# EAGLE design JetBot_Verteiler (EAGLE 9.3.0)
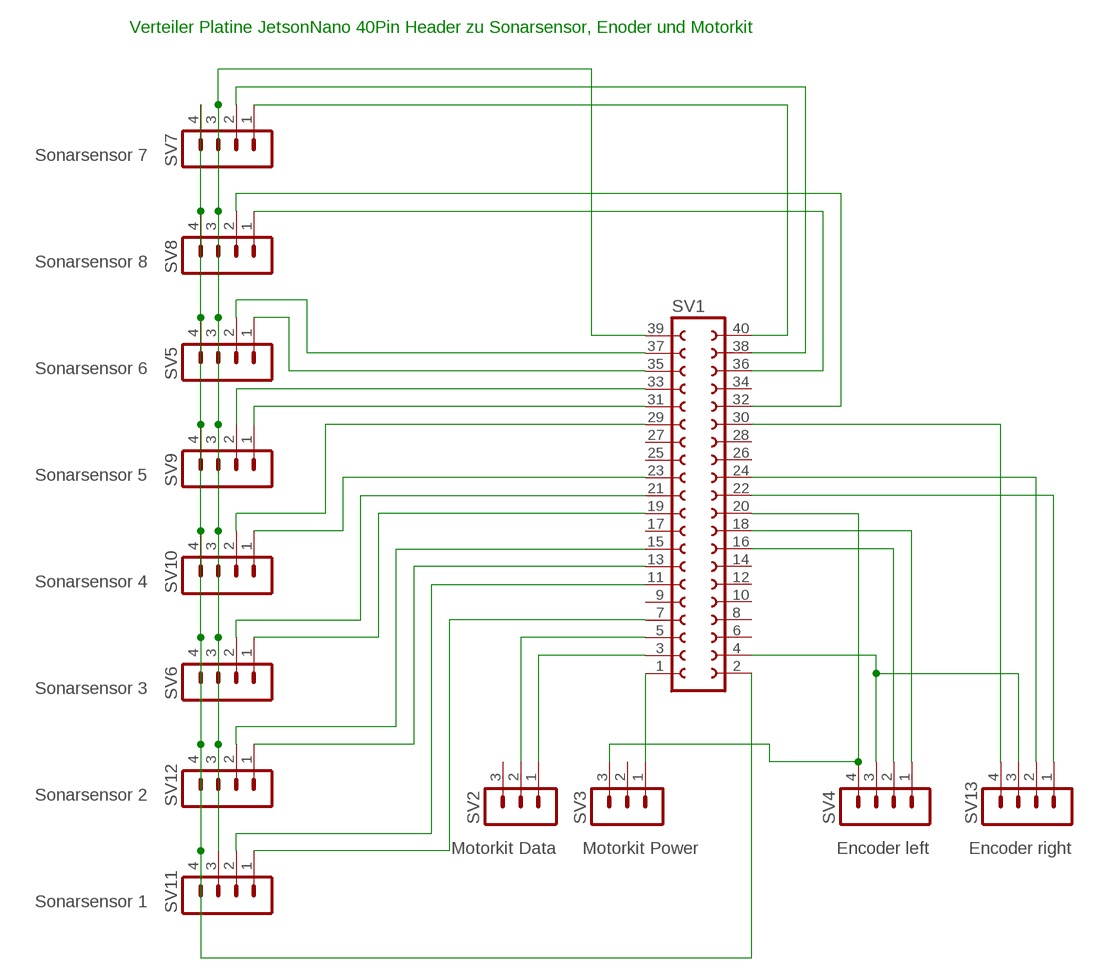
[diagram p0: schematic, sheet 1]

## Parts
SV1  FE20-2  [FE20-2]
SV2  Motorkit Data  MA03-1  [MA03-1]
SV3  Motorkit Power  MA03-1  [MA03-1]
SV4  Encoder left  MA04-1  [MA04-1]
SV5  Sonarsensor 6  MA04-1  [MA04-1]
SV6  Sonarsensor 3  MA04-1  [MA04-1]
SV7  Sonarsensor 7  MA04-1  [MA04-1]
SV8  Sonarsensor 8  MA04-1  [MA04-1]
SV9  Sonarsensor 5  MA04-1  [MA04-1]
SV10  Sonarsensor 4  MA04-1  [MA04-1]
SV11  Sonarsensor 1  MA04-1  [MA04-1]
SV12  Sonarsensor 2  MA04-1  [MA04-1]
SV13  Encoder right  MA04-1  [MA04-1]

## Nets
N$1: SV1.1 SV3.1
N$2: SV1.3 SV2.1
N$3: SV1.5 SV2.2
N$4: SV1.24 SV13.2
N$5: SV1.20 SV3.3 SV4.4
N$6: SV1.7 SV11.1
N$7: SV1.2 SV5.4 SV6.4 SV7.4 SV8.4 SV9.4 SV10.4 SV11.4 SV12.4
N$8: SV1.11 SV11.2
N$9: SV1.13 SV12.1
N$10: SV1.15 SV12.2
N$11: SV1.37 SV5.2
N$12: SV1.29 SV10.2
N$13: SV1.32 SV8.2
N$14: SV1.33 SV9.2
N$15: SV1.19 SV6.1
N$16: SV1.21 SV6.2
N$17: SV1.23 SV10.1
N$18: SV1.31 SV9.1
N$19: SV1.40 SV7.1
N$20: SV1.38 SV7.2
N$21: SV1.4 SV4.3 SV13.3
N$22: SV1.16 SV4.2
N$23: SV1.18 SV4.1
N$24: SV1.35 SV5.1
N$25: SV1.22 SV13.1
N$26: SV1.36 SV8.1
N$27: SV1.39 SV5.3 SV6.3 SV7.3 SV8.3 SV9.3 SV10.3 SV11.3 SV12.3
N$28: SV1.30 SV13.4
Unconnected: SV1.6 SV1.8 SV1.9 SV1.10 SV1.12 SV1.14 SV1.17 SV1.25 SV1.26 SV1.27 SV1.28 SV1.34 SV2.3 SV3.2

## Notes on the sheet
- Verteiler Platine JetsonNano 40Pin Header zu Sonarsensor, Enoder und Motorkit

## Library data of the parts
SV1 = con-lsta:FE20-2: FEMALE HEADER; OC_FARNELL: unknown; OC_NEWARK: unknown
SV2 SV3 = con-lstb:MA03-1: PIN HEADER; OC_FARNELL: unknown; OC_NEWARK: unknown
SV4-SV13 = con-lstb:MA04-1: PIN HEADER; OC_FARNELL: unknown; OC_NEWARK: unknown

## Board
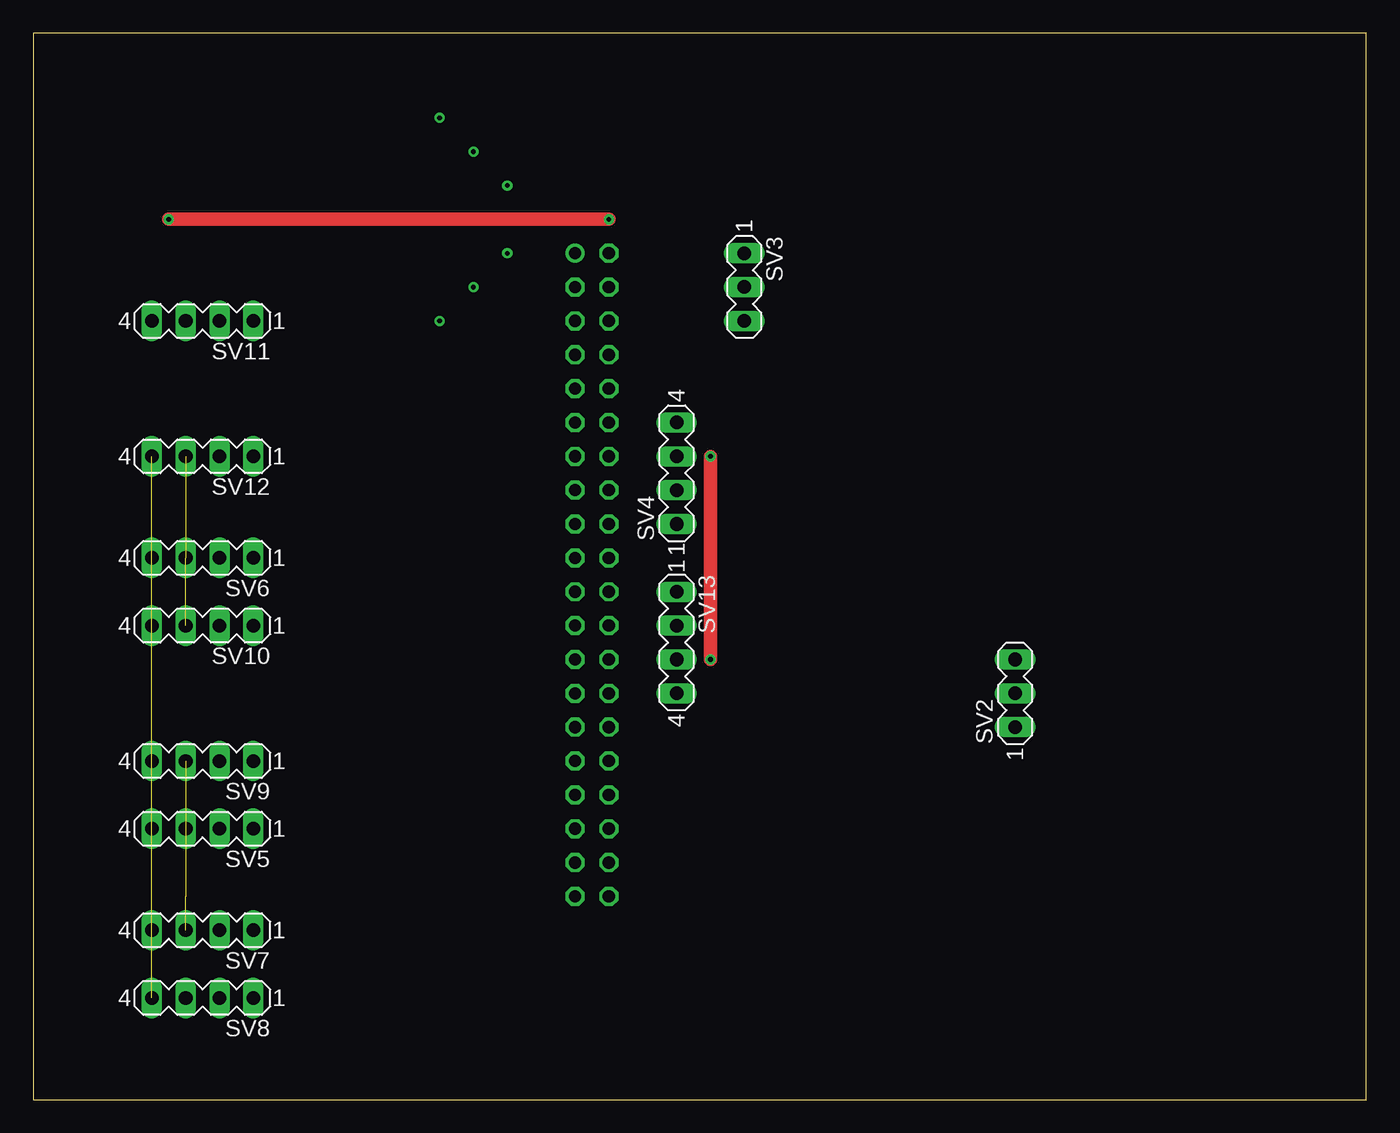
[diagram p1: board, top side]
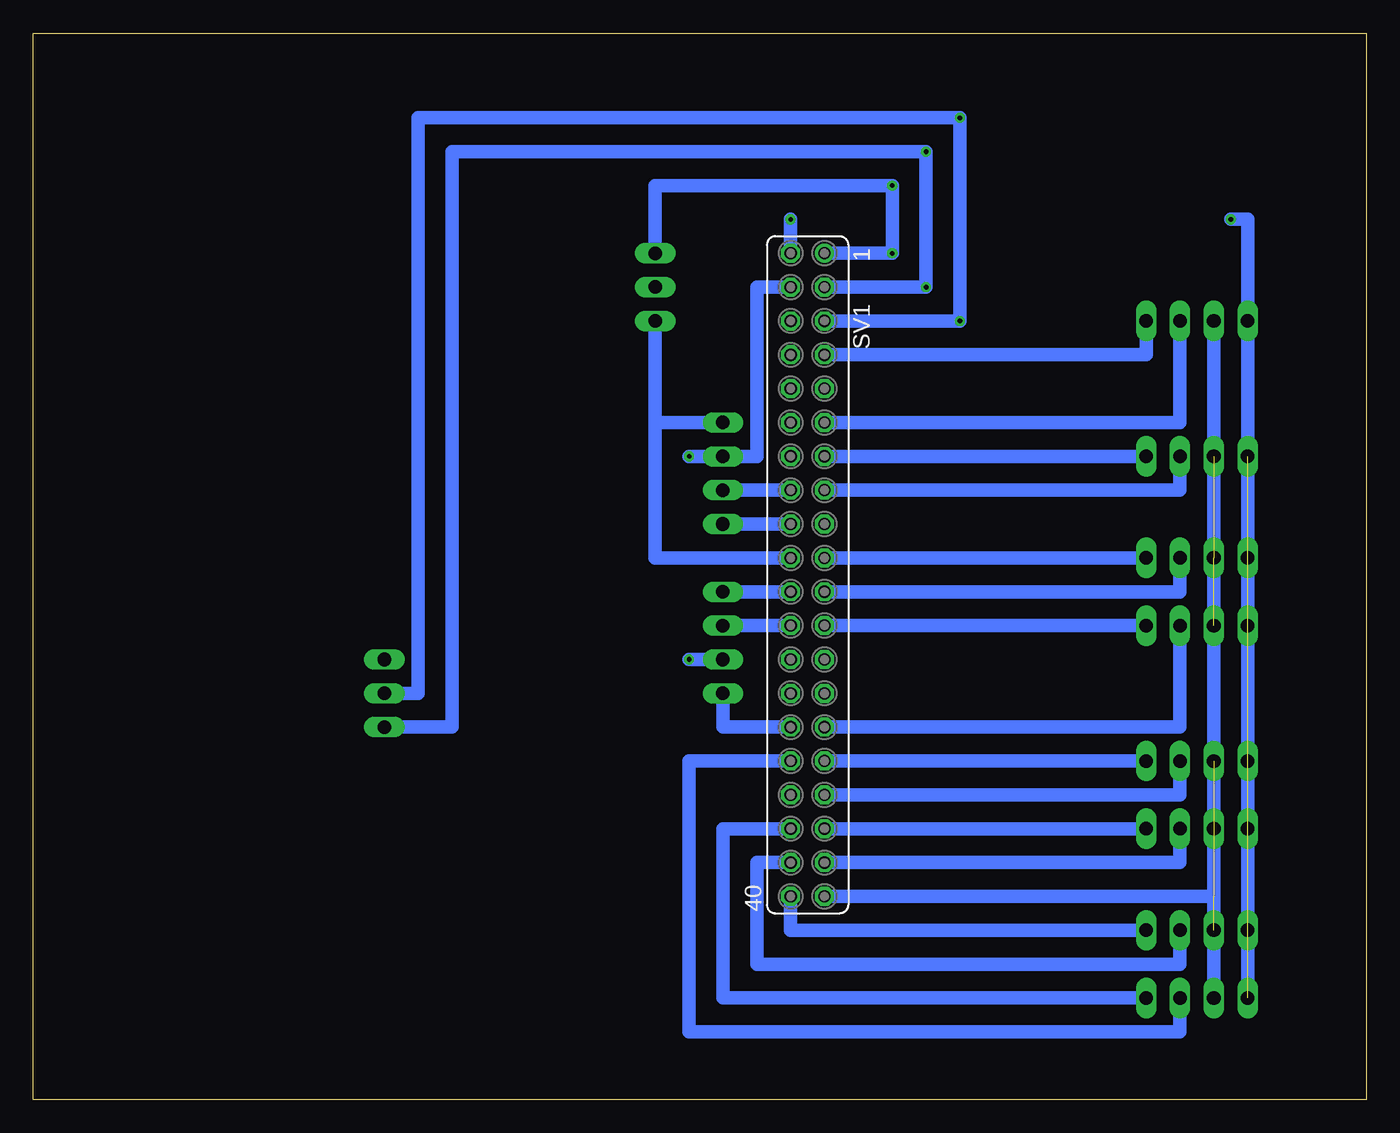
[diagram p2: board, bottom side, seen from below]

Size 100 x 80 mm. Coordinates in mm from the lower left corner, seen from the top.
Outline: 0,0 100,0 100,80 0,80 0,0
Copper layers (1*16): Top 0.035mm / dielectric 1.5mm / Bottom 0.035mm
Design rules "default": minimum track width 6mil, minimum drill 0.35mm, track to track 6mil, track to pad 6mil, pad to pad 6mil, via to via 6mil, smd to smd 6mil, copper to edge 40mil, drill to drill 6mil, minimum pad ring 10mil, minimum via ring 8mil, stop-mask expansion 4mil, vias tented up to drill 0mil, thermal gap 10mil

### Footprints (pad centres in the part's own frame; a part is rotated, then mirrored left to right if it is on the bottom)
FE20-2 = drill 0.914: 1 -24.13,1.27 | drill 0.914 octagon: 2 -24.13,-1.27; 3 -21.59,1.27; 4 -21.59,-1.27; 5 -19.05,1.27; 6 -19.05,-1.27; 7 -16.51,1.27; 8 -16.51,-1.27; 9 -13.97,1.27; 10 -13.97,-1.27; 11 -11.43,1.27; 12 -11.43,-1.27; 13 -8.89,1.27; 14 -8.89,-1.27; 15 -6.35,1.27; 16 -6.35,-1.27; 17 -3.81,1.27; 18 -3.81,-1.27; 19 -1.27,1.27; 20 -1.27,-1.27; 21 1.27,1.27; 22 1.27,-1.27; 23 3.81,1.27; 24 3.81,-1.27; 25 6.35,1.27; 26 6.35,-1.27; 27 8.89,1.27; 28 8.89,-1.27; 29 11.43,1.27; 30 11.43,-1.27; 31 13.97,1.27; 32 13.97,-1.27; 33 16.51,1.27; 34 16.51,-1.27; 35 19.05,1.27; 36 19.05,-1.27; 37 21.59,1.27; 38 21.59,-1.27; 39 24.13,1.27; 40 24.13,-1.27
MA03-1 = drill 1.016 long: 1 -2.54,0; 2 0,0; 3 2.54,0
MA04-1 = drill 1.016 long: 1 -3.81,0; 2 -1.27,0; 3 1.27,0; 4 3.81,0

### Placement (x,y rotation side)
SV1  41.91,39.37 270 bottom
SV2  73.66,30.48 90 top
SV3  53.34,60.96 270 top
SV4  48.26,46.99 90 top
SV5  12.7,20.32 180 top
SV6  12.7,40.64 180 top
SV7  12.7,12.7 180 top
SV8  12.7,7.62 180 top
SV9  12.7,25.4 180 top
SV10  12.7,35.56 180 top
SV11  12.7,58.42 180 top
SV12  12.7,48.26 180 top
SV13  48.26,34.29 270 top

### Tracks (layer width: path | path; a pad name or v marks a point on that pad's centre or on a via)
N$1  (via drill 0.35)
  Bottom 1.016: SV1.1 v35.56,63.5 v35.56,68.58 53.34,68.58 SV3.1
N$2  (via drill 0.35)
  Bottom 1.016: SV1.3 v33.02,60.96 v33.02,71.12 68.58,71.12 68.58,27.94 SV2.1
N$3  (via drill 0.35)
  Bottom 1.016: SV2.2 71.12,30.48 71.12,73.66 v30.48,73.66 v30.48,58.42 SV1.5
N$4
  Bottom 1.016: SV1.24 SV13.2
N$5
  Bottom 1.016: SV1.20 53.34,40.64 53.34,50.8 | 53.34,50.8 SV3.3 | SV4.4 53.34,50.8
N$6
  Bottom 1.016: SV1.7 16.51,55.88 SV11.1
N$7  (via drill 0.35)  (6 unrouted)
  Top 1.016: v43.18,66.04 v10.16,66.04
  Bottom 1.016: v43.18,66.04 SV1.2 | SV8.4 SV11.4 8.89,66.04 v10.16,66.04
N$8
  Bottom 1.016: SV1.11 13.97,50.8 SV11.2
N$9
  Bottom 1.016: SV1.13 SV12.1
N$10
  Bottom 1.016: SV1.15 13.97,45.72 SV12.2
N$11
  Bottom 1.016: SV1.37 13.97,17.78 SV5.2
N$12
  Bottom 1.016: SV10.2 13.97,27.94 SV1.29
N$13
  Bottom 1.016: SV8.2 13.97,5.08 50.8,5.08 50.8,25.4 SV1.32
N$14
  Bottom 1.016: SV1.33 13.97,22.86 SV9.2
N$15
  Bottom 1.016: SV6.1 SV1.19
N$16
  Bottom 1.016: SV1.21 13.97,38.1 SV6.2
N$17
  Bottom 1.016: SV1.23 SV10.1
N$18
  Bottom 1.016: SV1.31 SV9.1
N$19
  Bottom 1.016: SV7.1 43.18,12.7 SV1.40
N$20
  Bottom 1.016: SV7.2 13.97,10.16 45.72,10.16 45.72,17.78 SV1.38
N$21  (via drill 0.35)
  Top 1.016: v50.8,48.26 v50.8,33.02
  Bottom 1.016: SV1.4 45.72,60.96 45.72,48.26 SV4.3 v50.8,48.26 | SV13.3 v50.8,33.02
N$22
  Bottom 1.016: SV1.16 SV4.2
N$23
  Bottom 1.016: SV1.18 SV4.1
N$24
  Bottom 1.016: SV1.35 SV5.1
N$25
  Bottom 1.016: SV1.22 SV13.1
N$26
  Bottom 1.016: SV8.1 48.26,7.62 48.26,20.32 SV1.36
N$27  (5 unrouted)
  Bottom 1.016: SV11.3 SV12.3 11.43,15.24 | 11.43,15.24 SV8.3 | SV1.39 11.43,15.24
N$28
  Bottom 1.016: SV1.30 48.26,27.94 SV13.4